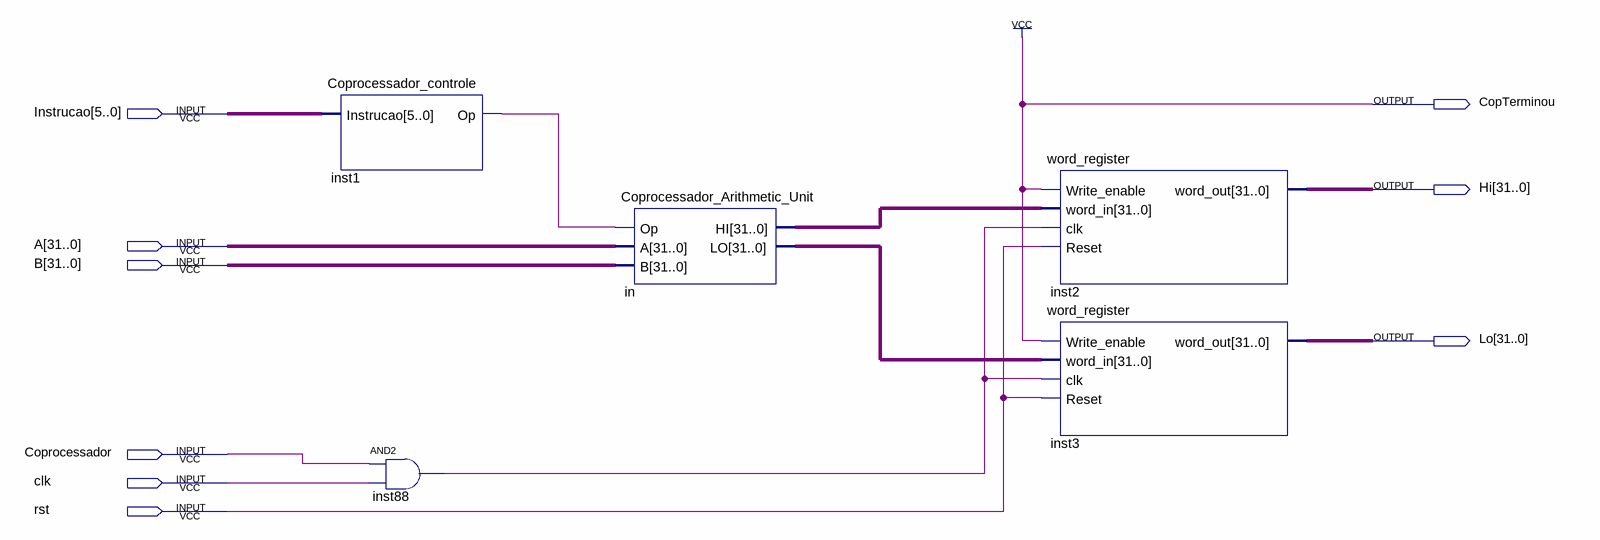
[diagram p0: schematic sheet]
// Quartus schematic Coprocessador.bdf as structural Verilog: 5 symbols, 9 pins
module Coprocessador (
  input  [5:0] Instrucao,
  input  [31:0] A,
  input  [31:0] B,
  input  Coprocessador,
  input  clk,
  input  rst,
  output CopTerminou,
  output [31:0] Hi,
  output [31:0] Lo
);

  wire inst1_op, inst88_out;
  wire [31:0] in_hi, in_lo;

  Coprocessador_controle inst1 (.Instrucao(Instrucao), .Op(inst1_op));
  and inst88 (inst88_out, Coprocessador, clk);
  Coprocessador_Arithmetic_Unit in (.Op(inst1_op), .A(A), .B(B), .HI(in_hi), .LO(in_lo));
  word_register inst2 (.Write_enable(1'b1), .word_in(in_hi), .clk(inst88_out), .Reset(rst), .word_out(Hi));
  word_register inst3 (.Write_enable(1'b1), .word_in(in_lo), .clk(inst88_out), .Reset(rst), .word_out(Lo));

  assign CopTerminou = 1'b1;
endmodule
